# EAGLE design Serial_CAN_Bus_V1.2 (EAGLE 6.4)
DESCRIPTION: microOBD 200 OBD-II Module; HW_REV: 1.4; PCB_REV: C; PCB_SPEC1: Layer Count: 4; PCB_SPEC2: Size: 1.3" x 0.59"; PCB_SPEC3: Finish Thickness: 0.049" - 0.052"; PCB_SPEC4: Copper Weight: 1oz; TITLE: STM1120

## Sheet 1 of 2
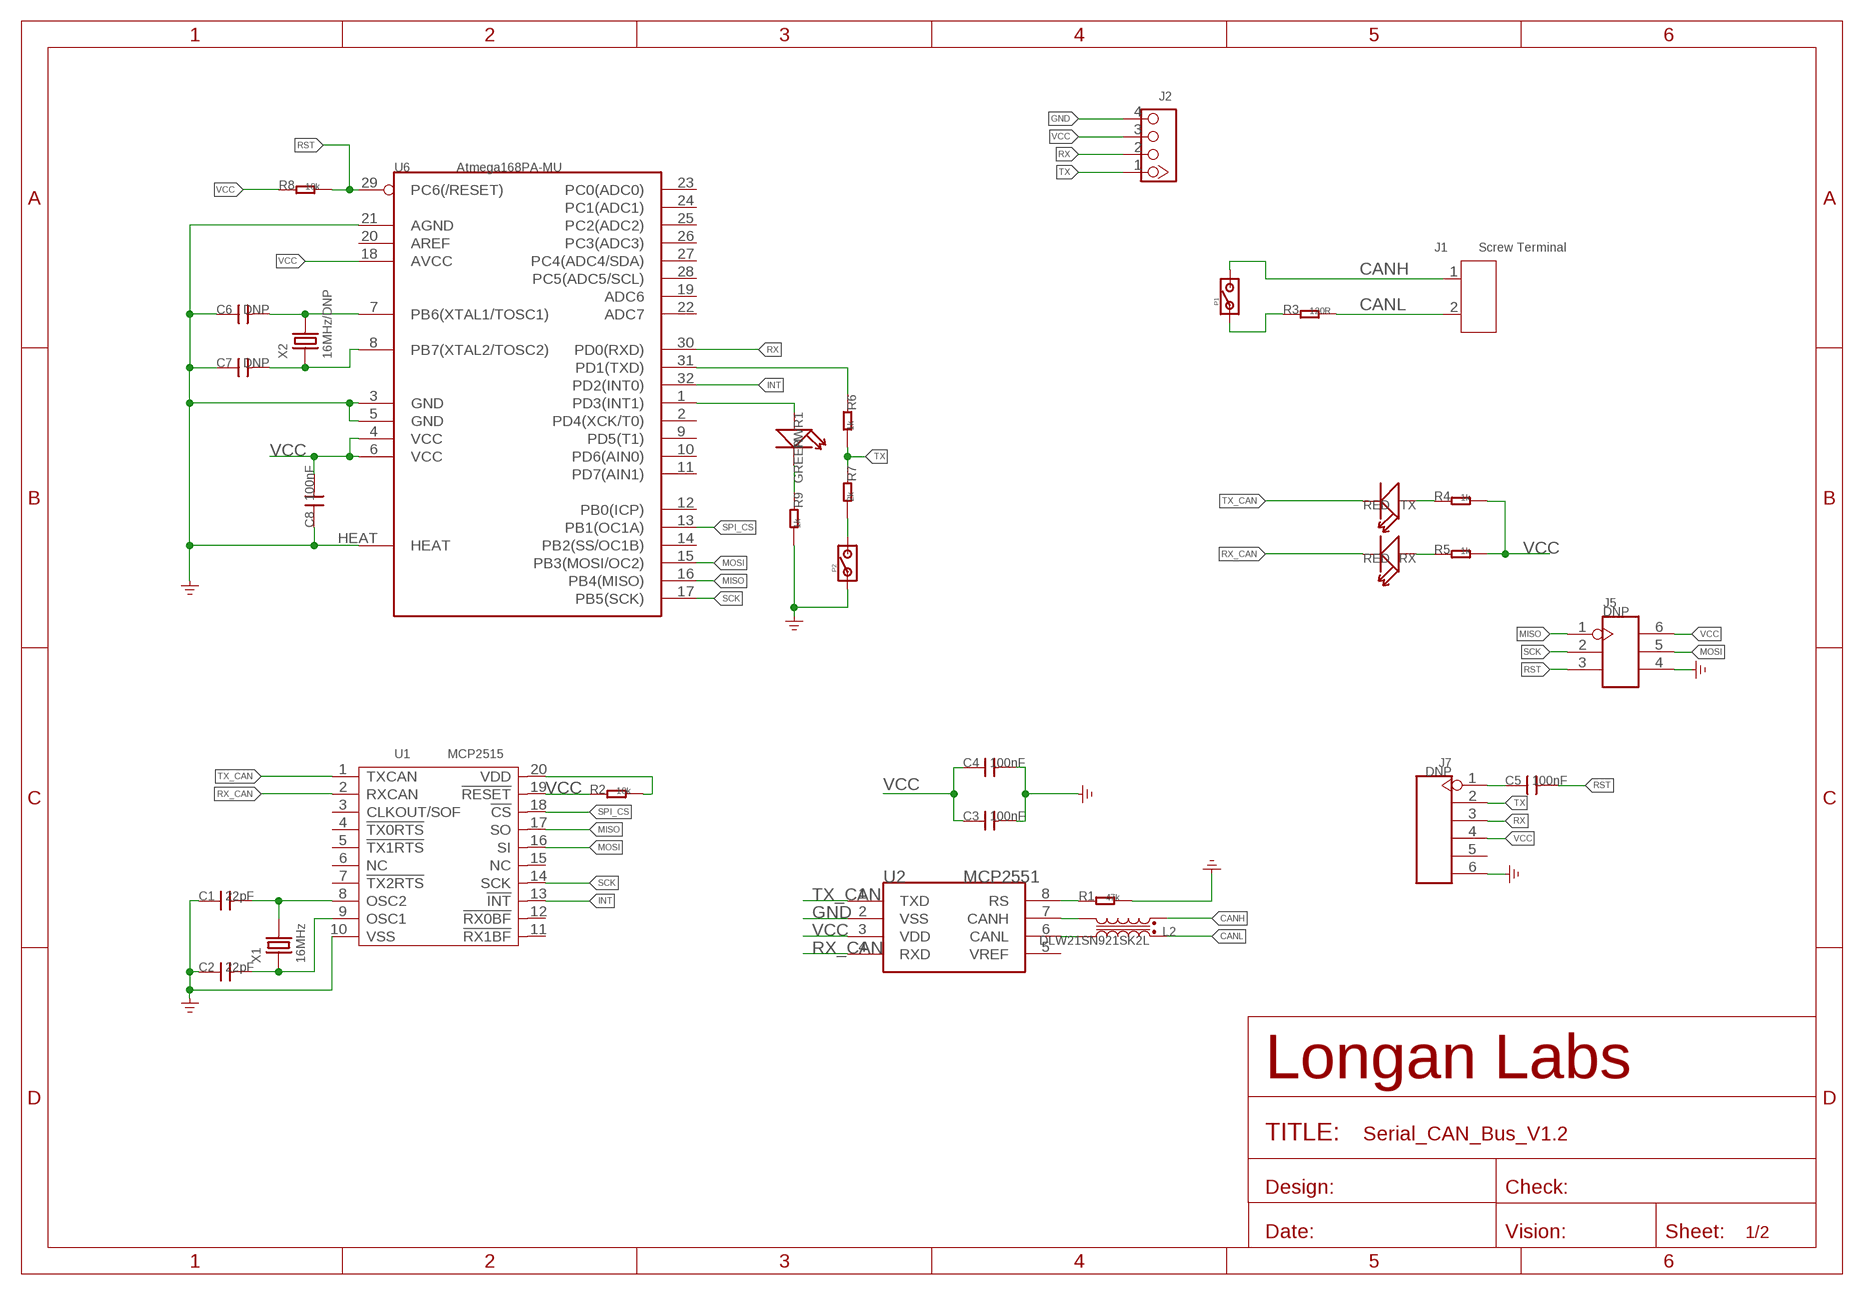
[diagram p0: schematic, sheet 1]

### Parts
C1  22pF  C-0603  [0603]
C2  22pF  C-0603  [0603]
C3  100nF  C-0603  [0603]
C4  100nF  C-0603  [0603]
C5  100nF  C-0603  [0603]
C6  DNP  C-0603  [0603]
C7  DNP  C-0603  [0603]
C8  100nF  C-0603  [0603]
J1  Screw Terminal  SCREW-TERMINAL-2P'3.5'  [2P-3.5]
J2  320110033  GROVE-CONNECTOR-DIP-2.0  [HW4-2.0]
J5  DNP  HEADER-2X3P-2.0-1.143  [H2X3-SMD-2.0(1.143)]
J7  DNP  HEADER-6P-55/35MIL  [H6-2.54]
L2  DLW21SN921SK2L  INDUCTOR-COMMON-MODE-SRF2012-900YA  [INT4-0.85-2X1.25X1.2MM]
P1  PAD-JUMPER-2P  [2P-SMD-1.78X1.27]
P2  PAD-JUMPER-2P  [2P-SMD-1.78X1.27]
PWR1  GREEN  LED'0603'  [LED-0603]
R1  47k  R-0603  [0603]
R2  10k  R-0603  [0603]
R3  120R  R-0603  [0603]
R4  1k  R-0603  [0603]
R5  1k  R-0603  [0603]
R6  1k  R-0603  [0603]
R7  2k  R-0603  [0603]
R8  10k  R-0603  [0603]
R9  1k  R-0603  [0603]
RX  RED  LED'0603'  [LED-0603]
TX  RED  LED'0603'  [LED-0603]
U1  MCP2515  MCP2515'ST'  [TSSOP20-0.65-6.5X4.4MM]
U2  MCP2551  MCP2551-SOIC8  [SOIC8-6.0]
U6  Atmega168PA-MU  MEGA8  [MLF32X]
X1  16MHz  CRYSTAL-2P'5032'  [X2-SMD-5.0X3.2X1.3MM]
X2  16MHz/DNP  CRYSTAL-2P'5032'  [X2-SMD-5.0X3.2X1.3MM]

### Nets
CANH: J1.1 L2.4 P1.2
CANL: J1.2 L2.1 R3.2
GND: C1.1 C2.1 C3.2 C4.2 C6.1 C7.1 C8.1 J2.4 J5.4 J7.6 P2.1 R1.2 R9.2 U1.10(VSS) U2.2(VSS) U6.3(GND) U6.5(GND) U6.21(AGND) U6.HEAT ; supply symbol labelled GND_POWER
INT: U1.13(!INT) U6.32(PD2(INT0))
MISO: J5.1 U1.17(SO) U6.16(PB4(MISO))
MOSI: J5.5 U1.16(SI) U6.15(PB3(MOSI/OC2))
N$1: P1.1 R3.1
N$2: R4.1 TX.+
N$3: C6.2 U6.7(PB6(XTAL1/TOSC1)) X2.2
N$4: C7.2 U6.8(PB7(XTAL2/TOSC2)) X2.1
N$5: C5.1 J7.1
N$6: PWR1.+ U6.1(PD3(INT1))
N$7: PWR1.- R9.1
N$8: R6.1 U6.31(PD1(TXD))
N$9: L2.3 U2.7(CANH)
N$10: P2.2 R7.2
N$11: L2.2 U2.6(CANL)
N$15: R5.1 RX.+
N$16: C1.2 U1.8(OSC2) X1.2
N$17: C2.2 U1.9(OSC1) X1.1
N$20: R1.1 U2.8(RS)
RST: C5.2 J5.3 R8.2 U6.29(PC6(/RESET))
RST_N: R2.1 U1.19(!RESET)
RX: J2.2 J7.3 U6.30(PD0(RXD))
RX_CAN: RX.- U1.2(RXCAN) U2.4(RXD)
SCK: J5.2 U1.14(SCK) U6.17(PB5(SCK))
SPI_CS: U1.18(!CS) U6.13(PB1(OC1A))
TX: J2.1 J7.2 R6.2 R7.1
TX_CAN: TX.- U1.1(TXCAN) U2.1(TXD)
VCC: C3.1 C4.1 C8.2 J2.3 J5.6 J7.4 R2.2 R4.2 R5.2 R8.1 U1.20(VDD) U2.3(VDD) U6.4(VCC) U6.6(VCC) U6.18(AVCC)
Unconnected: J7.5 U1.3(CLKOUT/SOF) U1.4(!TX0RTS) U1.5(!TX1RTS) U1.6(NC) U1.7(!TX2RTS) U1.11(!RX1BF) U1.12(!RX0BF) U1.15(NC) U2.5(VREF) U6.2(PD4(XCK/T0)) U6.9(PD5(T1)) U6.10(PD6(AIN0)) U6.11(PD7(AIN1)) U6.12(PB0(ICP)) U6.14(PB2(SS/OC1B)) U6.19(ADC6) U6.20(AREF) U6.22(ADC7) U6.23(PC0(ADC0)) U6.24(PC1(ADC1)) U6.25(PC2(ADC2)) U6.26(PC3(ADC3)) U6.27(PC4(ADC4/SDA)) U6.28(PC5(ADC5/SCL))

## Sheet 2 of 2

## Library data of the parts
C1-C8 = Discrete:C*: Ceramic Capacitors
J1 = Connector-new:SCREW-TERMINAL-2P: 2P-3.5:320110028;2P-5.0:320110031
J2 = Connector-new:GROVE-CONNECTOR-DIP: 4P-2.0:320110033;4P-2.0-90D:320110034
J5 = Connector-new:HEADER-2X3P
J7 = Connector-new:HEADER-6P
L2 = Discrete-new:INDUCTOR-COMMON-MODE
P1 P2 = Discrete:PAD-JUMPER-2P
PWR1 RX TX = Discrete:LED*
R1-R9 = Discrete:R*
U1 = Heilight:MCP2515
U2 = IC:MCP2551: High-Speed CAN Transceiver http://ww1.microchip.com/downloads/en/devicedoc/21667f.pdf
U6 = ICs_v54:MEGA8
X1 X2 = Discrete-new:CRYSTAL-2P

## Net classes
0 default: width 0.152 mm, drill 0.254 mm, clearance 0.152 mm
3 usbvcc: width 0.152 mm, drill 0.152 mm, clearance 0.152 mm

## Board
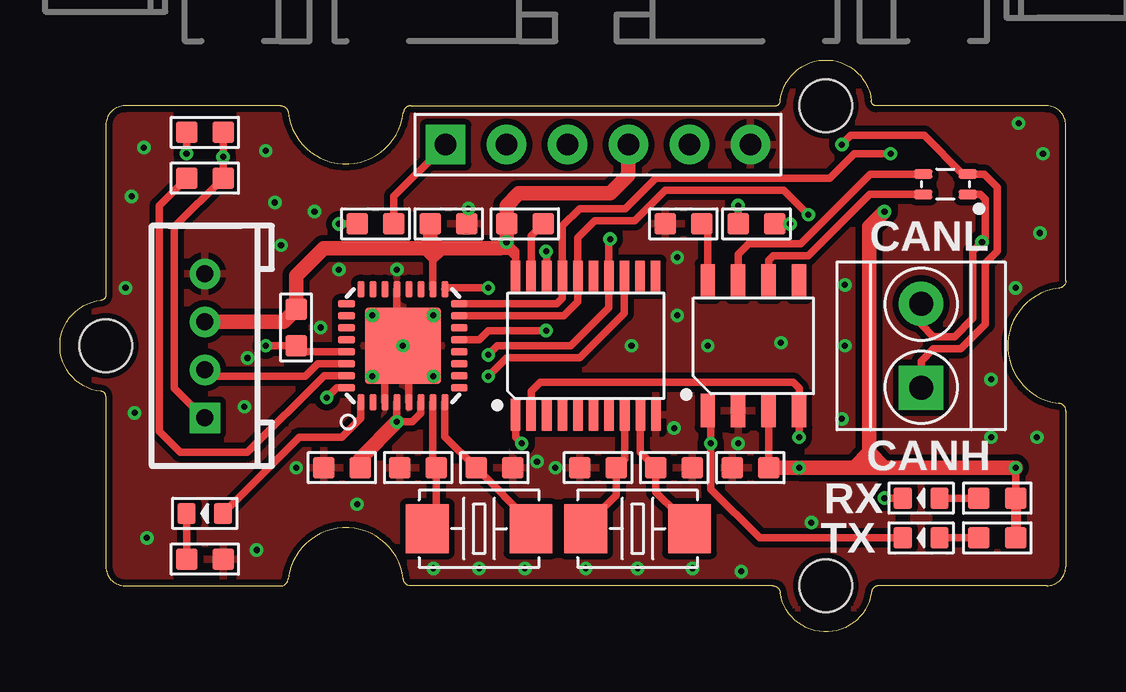
[diagram p1: board, top side]
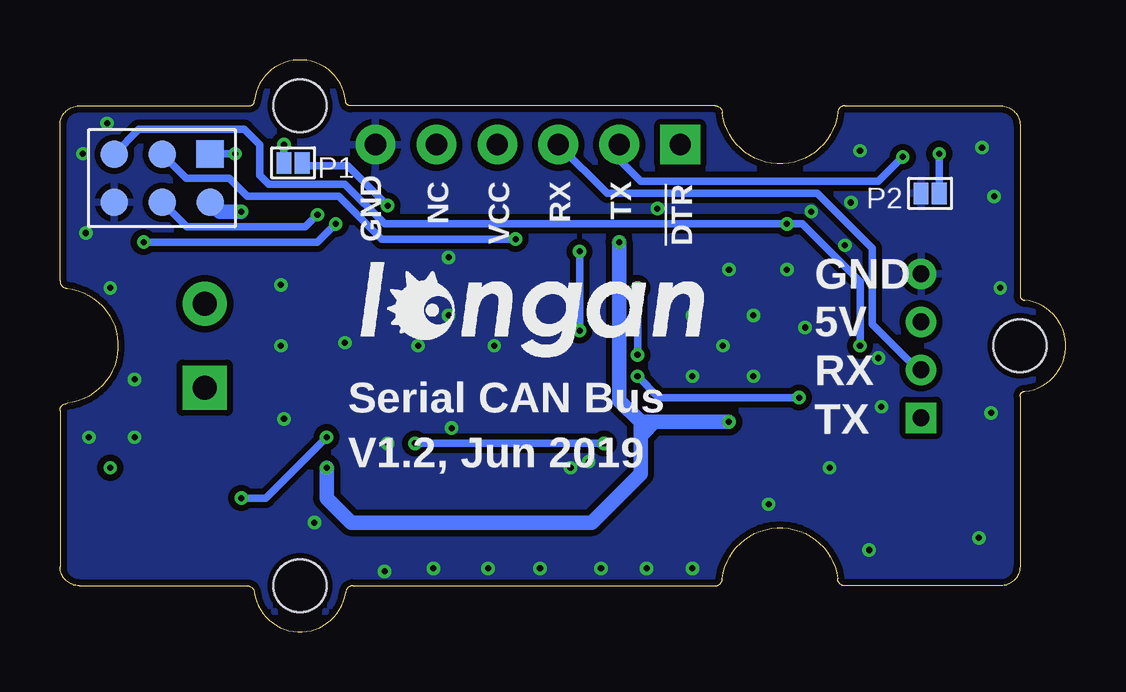
[diagram p2: board, bottom side, seen from below]

Size 41.91 x 23.83 mm. Coordinates in mm from the lower left corner, seen from the top.
Copper layers (1*16): Top 0.035mm / dielectric 1.5mm / Bottom 0.035mm
Design rules "SeeedStudio_2layer_DRU_no_angle_20140221 *": minimum track width 6mil, minimum drill 10mil, track to track 6mil, track to pad 6mil, pad to pad 6mil, via to via 6mil, smd to smd 0mil, copper to edge 10mil, drill to drill 10mil, minimum pad ring 10mil, minimum via ring 6mil, stop-mask expansion 2mil, vias tented up to drill 25mil, thermal gap 10mil

### Footprints (pad centres in the part's own frame; a part is rotated, then mirrored left to right if it is on the bottom)
0603 = smd 0.889 x 0.889: 1 -0.762,0; 2 0.762,0
2P-3.5 = drill 1 pad 1.85 square: 1 -1.75,0 | drill 1 pad 1.85: 2 1.75,0
HW4-2.0 = drill 0.7 pad 1.27 square: 1 -3,0 | drill 0.7 pad 1.27: 2 -1,0; 3 1,0; 4 3,0
H2X3-SMD-2.0(1.143) = smd 1.143 x 1.143: 1 -1,2; 2 -1,0; 3 -1,-2; 4 1,-2; 5 1,0; 6 1,2
H6-2.54 = drill 0.889 pad 1.651 square: 1 0,6.35 | drill 0.889 pad 1.651: 2 0,3.81; 3 0,1.27; 4 0,-1.27; 5 0,-3.81; 6 0,-6.35
INT4-0.85-2X1.25X1.2MM = smd 0.4 x 0.75: 1 -0.425,-0.925; 2 -0.425,0.925; 3 0.425,0.925; 4 0.425,-0.925
2P-SMD-1.78X1.27 = smd 0.889 x 0.61: 1 0,0.381; 2 0,-0.381
LED-0603 = smd 0.762 x 0.889: + -0.762,0; - 0.762,0
TSSOP20-0.65-6.5X4.4MM = smd 0.4 x 1.35: 1 -2.925,-2.875; 2 -2.275,-2.875; 3 -1.625,-2.875; 4 -0.975,-2.875; 5 -0.325,-2.875; 6 0.325,-2.875; 7 0.975,-2.875; 8 1.625,-2.875; 9 2.275,-2.875; 10 2.925,-2.875; 11 2.91,2.875; 12 2.26,2.875; 13 1.61,2.875; 14 0.96,2.875; 15 0.325,2.875; 16 -0.325,2.875; 17 -0.975,2.875; 18 -1.625,2.875; 19 -2.275,2.875; 20 -2.925,2.875
SOIC8-6.0 = smd 0.6 x 1.4: 1 -1.905,-2.7; 2 -0.635,-2.7; 3 0.635,-2.7; 4 1.905,-2.7; 5 1.905,2.7; 6 0.635,2.7; 7 -0.635,2.7; 8 -1.905,2.7
GROVE-TEST-PLATFORM = hole 2.2: -10,-10; -10,10; 20,0
MLF32X = smd 0.7 x 0.3: 1 -2.35,1.75; 2 -2.35,1.25; 3 -2.35,0.75; 4 -2.35,0.25; 5 -2.35,-0.25; 6 -2.35,-0.75; 7 -2.35,-1.25; 8 -2.35,-1.75; 17 2.35,-1.75; 18 2.35,-1.25; 19 2.35,-0.75; 20 2.35,-0.25; 21 2.35,0.25; 22 2.35,0.75; 23 2.35,1.25; 24 2.35,1.75 | smd 0.3 x 0.7: 9 -1.75,-2.35; 10 -1.25,-2.35; 11 -0.75,-2.35; 12 -0.25,-2.35; 13 0.25,-2.35; 14 0.75,-2.35; 15 1.25,-2.35; 16 1.75,-2.35; 25 1.75,2.35; 26 1.25,2.35; 27 0.75,2.35; 28 0.25,2.35; 29 -0.25,2.35; 30 -0.75,2.35; 31 -1.25,2.35; 32 -1.75,2.35 | smd 3.175 x 3.175: HEAT 0,0
X2-SMD-5.0X3.2X1.3MM = smd 1.778 x 2.032: 1 -2.159,0; 2 2.159,0

### Placement (x,y rotation side)
C1  22.42,6.84 0 top
C2  25.59,6.84 180 top
C3  28.77,6.84 180 top
C4  16.19,17 0 top
C5  13.15,17 180 top
C6  14.92,6.84 0 top
C7  18.1,6.84 180 top
C8  11.75,6.84 0 top
J1  35.88,11.92 90 top
J2  6.03,11.92 90 top
J5  37.66,18.91 270 bottom
J7  22.42,20.3 90 top
L2  36.89,18.65 90 top
P1  32.2,19.54 270 bottom
P2  5.65,18.27 90 bottom
PWR1  6.03,4.94 180 top
R1  25.97,17 180 top
R2  19.37,17 180 top
R3  29.02,17 0 top
R4  39.05,3.92 0 top
R5  39.05,5.57 0 top
R6  6.03,18.91 0 top
R7  6.03,20.81 180 top
R8  9.84,12.68 270 top
R9  6.03,3.03 0 top
RX  35.88,5.57 180 top
TX  35.88,3.92 180 top
U1  21.91,11.92 0 top
U2  28.89,11.92 0 top
U3  [GROVE-TEST-PLATFORM]  21.91,11.92 180 top
U6  14.29,11.92 90 top
U$5  [LONGAN-SILK-SMALLER]  30.67,10.27 0 bottom
X1  24.07,4.3 180 top
X2  17.46,4.3 180 top

### Tracks (layer width: path | path; a pad name or v marks a point on that pad's centre or on a via)
CANH  (via drill 0.25 pad 0.51)
  Top 0.305: J1.1 35.88,11.29 36.39,11.79 37.53,11.79 38.55,12.81 38.55,15.35 39.05,15.86 39.05,18.53 38.5,19.08 L2.4 37.61,19.08 36.01,20.68 32.96,20.68 v32.58,20.3
  Bottom 0.305: P1.2 v32.58,20.3
CANL  (via drill 0.25 pad 0.51)
  Top 0.305: J1.2 35.88,12.81 36.39,12.3 37.28,12.3 38.04,13.06 38.04,15.86 v38.42,16.24 38.55,16.24 38.55,18.02 38.34,18.23 L2.1 | R3.2 v30.42,17
  Bottom 0.305: v30.42,17 31.18,16.24 v38.42,16.24
GND  (via drill 0.25 pad 0.51)
  Top 0.305: U6.21 14.04,12.69 14.03,12.68 14.03,12.18 U6.HEAT | U6.5 14.54,11.67 U6.HEAT | U6.3 13.54,11.55 13.65,11.67 14.03,11.67 U6.HEAT
  other vias: 17.02,17.64 13.02,13.19 15.56,13.19 15.56,10.65 13.02,10.65 14.29,11.92 9.84,6.84 12.38,5.32 20.64,6.84 19.88,7.1 25.59,8.49 28.26,7.86 28.39,2.52 31.31,4.56 25.72,15.6 25.72,13.19 23.81,11.92 26.99,11.92 2.73,14.33 3.49,20.18 32.7,14.46 15.56,2.65 17.46,2.65 19.37,2.65 21.91,2.65 24.07,2.65 26.35,2.65 2.99,18.14 3.11,9.13 3.62,3.92 8.19,3.41 7.68,9.38 7.81,11.41 32.7,11.92 32.58,8.87 30.04,12.05 11.62,15.1 14.03,15.1 8.95,17.89 8.57,20.05 38.8,8.11 40.7,8.11 38.8,10.52 9.21,16.11 10.61,17.51 39.82,14.33 40.83,16.62 40.96,19.92 39.94,21.19 10.86,12.68
  pour Bottom (isolate 0.254): -0.32,-0.14 42.23,-0.14 42.23,23.99 -0.32,23.99
  pour Top (isolate 0.254): -0.32,-0.14 42.23,-0.14 42.23,23.99 -0.32,23.99
INT  (via drill 0.25 pad 0.51)
  Top 0.305: U6.32 11.52,10.17 v11.11,9.76 | U1.13 23.52,13.28 21.65,11.41 18.61,11.41 v17.84,10.65
  Bottom 0.305: v17.84,10.65 16.96,9.76 v11.11,9.76
MISO  (via drill 0.25 pad 0.51)
  Top 0.305: U6.16 20.7,13.67 20.93,13.9 U1.17 20.93,16.92 21.65,17.64 23.56,17.64 24.83,18.91 32.07,18.91 33.08,19.92 v34.61,19.92
  Bottom 0.305: v34.61,19.92 35.64,19.92 J5.1
MOSI  (via drill 0.25 pad 0.51)
  Top 0.305: U6.15 20.99,13.17 21.58,13.76 U1.16 21.58,16.42 22.29,17.13 23.94,17.13 25.21,18.4 30.16,18.4 v31.18,17.38
  Bottom 0.305: v31.18,17.38 31.69,16.87 36.62,16.87 J5.5
N$1  (via drill 0.25 pad 0.51)
  Top 0.305: R3.1 v28.26,17.76
  Bottom 0.305: P1.1 31.81,19.41 29.91,19.41 v28.26,17.76
N$2
  Top 0.305: R4.1 TX.+
N$3
  Top 0.305: U6.7 15.54,6.99 C6.2 15.69,3.92 | 15.69,3.92 15.81,3.79 | 15.69,3.92 X2.2
N$4
  Top 0.305: U6.8 16.04,8.14 C7.2 19.62,4.56 X2.1
N$5
  Top 0.305: C5.1 13.91,18.14 J7.1
N$6
  Top 0.305: U6.1 12.54,8.9 11.75,8.11 9.97,8.11 PWR1.+
N$7
  Top 0.305: PWR1.- R9.1
N$8
  Top 0.305: U6.31 11.01,10.67 7.81,7.48 5.02,7.48 4.13,8.37 4.13,17.76 R6.1
N$9
  Top 0.305: U2.7 28.26,15.73 28.7,16.18 30.86,16.18 33.76,19.08 L2.3
N$10  (via drill 0.25 pad 0.51)
  Top 0.305: v5.27,19.92 R7.2
  Bottom 0.305: P2.2 v5.27,19.92
N$11
  Top 0.305: L2.2 33.74,18.23 31.18,15.67 29.72,15.67 29.53,15.48 U2.6
N$15
  Top 0.305: RX.+ R5.1
N$16
  Top 0.305: U1.8 23.53,7.2 C1.2 23.18,5.7 22.29,4.81 22.29,4.68 X1.2
N$17
  Top 0.305: U1.9 24.18,7.49 C2.2 24.83,5.83 25.72,4.94 25.72,4.81 X1.1
N$20
  Top 0.305: U2.8 26.99,16.75 R1.1
RST  (via drill 0.25 pad 0.51)
  Top 0.305: U6.29 9.85,11.67 R8.2 v8.57,11.92 | C5.2 v11.62,17
  Bottom 0.305: v8.57,11.92 8.57,14.59 10.99,17 v11.62,17 28.39,17 30.04,18.65 33.21,18.65 33.59,19.03 33.59,20.3 34.23,20.94 38.62,20.94 J5.3
RST_N
  Top 0.305: U1.19 19.63,16.5 R2.1
RX
  Top 0.305: U6.30 10.74,11.17 10.22,10.65 6.3,10.65 J2.2
  Bottom 0.305: J2.2 6.18,10.92 8.07,12.81 8.07,15.99 10.35,18.27 19.11,18.27 J7.3
RX_CAN  (via drill 0.25 pad 0.51)
  Top 0.305: U1.2 19.63,10.03 20,10.4 30.54,10.4 30.8,10.14 U2.4 v30.8,8.11 | RX.- v34.35,5.57
  Bottom 0.305: v30.8,8.11 33.34,5.57 v34.35,5.57
SCK  (via drill 0.25 pad 0.51)
  Top 0.305: v17.84,14.33 16.1,14.33 U6.17 | v17.84,11.54 18.23,11.92 21.27,11.92 22.87,13.52 U1.14 22.87,16.31 v22.92,16.37
  Bottom 0.305: v17.84,11.54 v17.84,14.33 | J5.2 36.66,18.91 34.86,18.91 34.1,18.14 30.29,18.14 28.51,16.37 v22.92,16.37
SPI_CS  (via drill 0.25 pad 0.51)
  Top 0.305: U1.18 20.28,15.83 v20.26,15.86 | v20.26,12.56 17.84,12.56 17.46,12.17 U6.13
  Bottom 0.305: v20.26,15.86 v20.26,12.56
TX  (via drill 0.25 pad 0.51)
  Top 0.305: J2.1 5.99,8.92 4.76,10.14 4.76,16.87 R6.2 v6.8,19.8 R7.1
  Bottom 0.305: J7.2 18.61,19.67 17.72,18.78 7.81,18.78 v6.8,19.8
TX_CAN  (via drill 0.25 pad 0.51)
  Top 0.305: TX.- 29.15,3.92 27.12,5.95 27.12,7.35 v27.12,7.86 27.12,9.09 U2.1 | U1.1 18.98,8.12 v19.24,7.86
  Bottom 0.305: v19.24,7.86 v27.12,7.86
VCC  (via drill 0.25 pad 0.51)
  Top 0.305: U6.4 v14.04,8.75 14.67,8.75 15.04,9.12 U6.6 | U1.20 18.98,15.67 | 18.98,15.67 18.98,15.86 v18.61,16.24 | U2.3 C3.1 | R5.2 v39.82,6.84 | U6.18 15.54,15.46 | 15.54,15.46 15.54,15.55 | 15.54,15.55 15.54,16.13 15.43,16.24 | 15.54,15.55 15.49,15.55 15.05,15.99 | 15.54,15.46 15.94,15.86 | 18.98,15.67 18.92,15.67 18.73,15.86 18.35,15.86
  Top 0.406: R5.2 R4.2
  Top 0.61: C3.1 v30.8,6.84 33.08,6.84 | C8.2 12.51,7.22 v14.04,8.75 | J2.3 9.32,12.92 R8.1 9.84,14.84 10.99,15.99 15.05,15.99 15.18,15.99 | 15.18,15.99 15.43,16.24 15.43,16.37 | 15.43,16.37 C4.1 | 15.18,15.99 15.81,15.99 | 15.81,15.99 18.35,15.99 v18.61,16.24 R2.2 18.61,17.76 19.11,18.27 22.92,18.27 23.69,19.03 J7.4 | 15.43,16.37 15.81,15.99 | 33.72,6.84 33.72,7.48 | 33.72,7.48 33.72,16.87 v34.35,17.51 | 33.08,6.84 33.72,6.84 | 33.72,6.84 34.35,6.84 | 34.35,6.84 v39.82,6.84 | 33.08,6.84 33.72,7.48 | 33.72,7.48 34.35,6.84
  Bottom 0.61: v18.61,16.24 18.61,9.64 17.72,8.75 | v30.8,6.84 30.8,5.57 29.78,4.56 19.75,4.56 17.72,6.59 17.72,8.75 | 17.72,8.75 17.15,8.75 | 17.15,8.75 v14.04,8.75 | 17.15,8.75 17.65,8.24 | v34.35,17.51 35.26,17.51 J5.6

### Text on the board
tPlace: CANL | CANH | RX | TX
bPlace: !DTR | TX | RX | VCC | NC | GND | P1 | P2 | GND | 5V | RX | Serial CAN Bus | TX | V1.2, Jun 2019
tValues: 168